# Altium schematic sheet 12V_to_5V_LDO_1A.SchDoc
size A
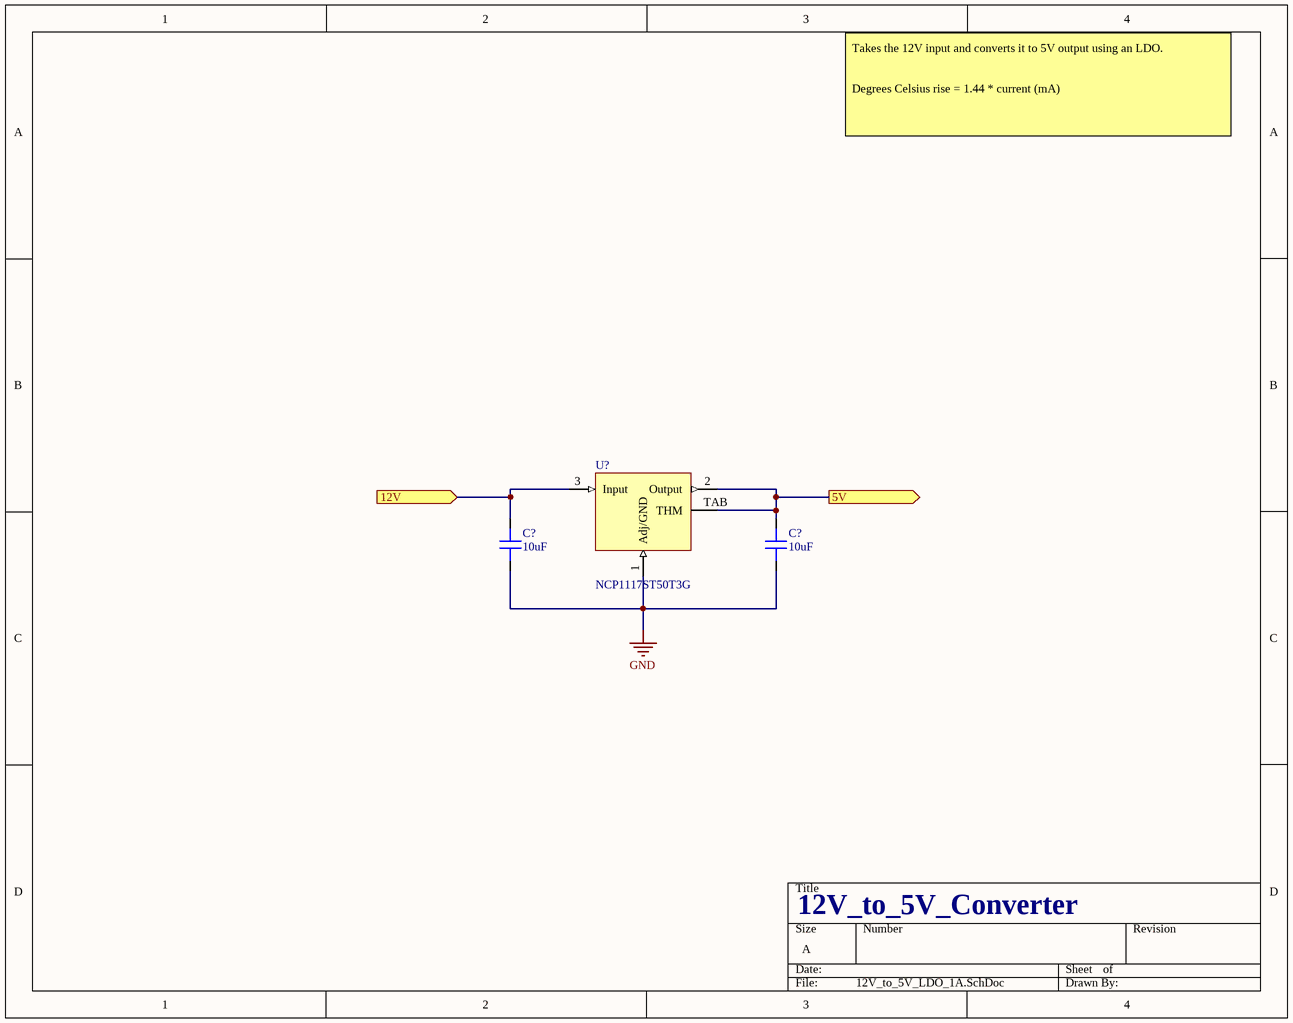
[diagram p0: 12V_to_5V_LDO_1A.SchDoc]

## Parts
(Parts that share a designator on the sheet are numbered #1, #2 ... from top to bottom, then left to right.)
C?#1  capacitance: 10uF  [0603]  (hidden comment: capacitor)
C?#2  capacitance: 10uF  [0603]  (hidden comment: capacitor)
U?  NCP1117ST50T3G  [SOT-223-3]

## Ports
5V (out), 12V (in)

## Nets
GND: C?#1.1 C?#2.1 U?.1(Adj/GND)
5V: C?#2.2 U?.2(Output) U?.TAB(THM) ; port 5V
12V: C?#1.2 U?.3(Input) ; port 12V

## Notes on the sheet
- Takes the 12V input and converts it to 5V output using an LDO.
  Degrees Celsius rise = 1.44 * current (mA)
- 12V_to_5V_Converter

## Library data of the parts
C?#1 C?#2 = 1: Generic 0603 capacitor; id: 1; voltage: 50; dielectric: Ceramic; percent tolerance: 10; name: 0603 Capacitor; ESR: 1; package: 0603; quantity: 0
U? = 16: 5V linear regulator; id: 16; imax: 1; name: NCP1117ST50T3G; package: SOT-223-3; quantity: 0; link: https://www.digikey.com/product-detail/en/on-semiconductor/NCP1117ST50T3G/NCP1117ST50T3GOSCT-ND/1967217